# Altium schematic sheet 18_GPS_Interface.SchDoc: =TitleParameter
size A3; Address: Crete IL; Organization: ASISGUARD; Address1: Kemalpasa, Kemalpasa Cd. No:290 D:292H, 35060 Bornova/Izmir/Turkey
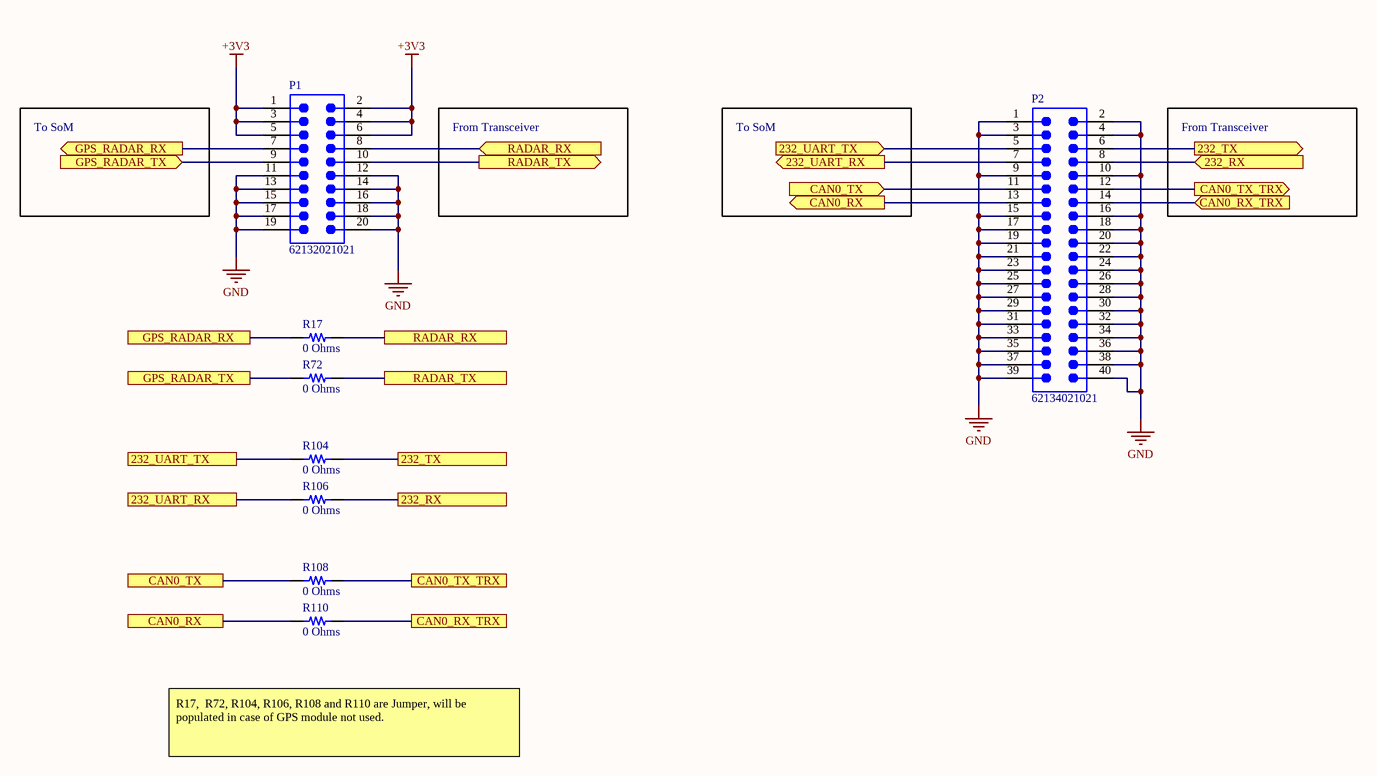
[diagram p0: 18_GPS_Interface.SchDoc]

## Parts
P1  62132021021  [62132021021]
P2  62134021021  [62134021021]
R17  0 Ohms  [RES0402(1005)]
R72  0 Ohms  [RES0402]
R104  0 Ohms  [RES0402(1005)]
R106  0 Ohms  [RES0402]
R108  0 Ohms  [RES0402(1005)]
R110  0 Ohms  [RES0402]

## Ports
232_RX, 232_RX (in), 232_TX, 232_TX (out), 232_UART_RX, 232_UART_RX (out), 232_UART_TX, 232_UART_TX (in), CAN0_RX, CAN0_RX (out), CAN0_RX_TRX, CAN0_RX_TRX (in), CAN0_TX, CAN0_TX (in), CAN0_TX_TRX, CAN0_TX_TRX (out), GPS_RADAR_RX, GPS_RADAR_RX (out), GPS_RADAR_TX, GPS_RADAR_TX (in), RADAR_RX, RADAR_RX (in), RADAR_TX, RADAR_TX (out)

## Nets
+3V3: P1.1 P1.2 P1.3 P1.4 P1.5 P1.6
GND: P1.11 P1.12 P1.13 P1.14 P1.15 P1.16 P1.17 P1.18 P1.19 P1.20 P2.1 P2.2 P2.3 P2.4 P2.9 P2.10 P2.15 P2.16 P2.17 P2.18 P2.19 P2.20 P2.21 P2.22 P2.23 P2.24 P2.25 P2.26 P2.27 P2.28 P2.29 P2.30 P2.31 P2.32 P2.33 P2.34 P2.35 P2.36 P2.37 P2.38 P2.39 P2.40
232_RX: P2.8 R106.1 ; port 232_RX
232_TX: P2.6 R104.1 ; port 232_TX
232_UART_RX: P2.7 R106.2 ; port 232_UART_RX
232_UART_TX: P2.5 R104.2 ; port 232_UART_TX
CAN0_RX: P2.13 R110.2 ; port CAN0_RX
CAN0_RX_TRX: P2.14 R110.1 ; port CAN0_RX_TRX
CAN0_TX: P2.11 R108.2 ; port CAN0_TX
CAN0_TX_TRX: P2.12 R108.1 ; port CAN0_TX_TRX
GPS_RADAR_RX: P1.7 R17.2 ; port GPS_RADAR_RX
GPS_RADAR_TX: P1.9 R72.2 ; port GPS_RADAR_TX
RADAR_RX: P1.8 R17.1 ; port RADAR_RX
RADAR_TX: P1.10 R72.1 ; port RADAR_TX

## Notes on the sheet
- To SoM
- From Transceiver
- R17,  R72, R104, R106, R108 and R110 are Jumper, will be populated in case of GPS module not used.
- Proje/Project:
- Sayfa Adı/Document Name:
- Çizilme Tarihi/Drawing Date
- Umit KAYACIK
- Tasarlayan/Designed By
- Sayfa/Sheet:
- Revision:
- of
- Son Güncelleme/Last Edit Date
- Kontrol eden/Checked By
- Onaylayan/Approved By
- Boyut/Size:
- Varyant/Variant:
- Dil/Language:
- A3
- ENG

## Library data of the parts
P1 = CMP-03913-122473367-2: 62132021021 Conn, Header, 20Pos, 2Row, 1.27Mm Rohs Compliant: Yes; NexarPartId: 122473367
P2 = CMP-03913-122473373-2: 62134021021 Conn, Header, 40Pos, 2Row, 1.27Mm Rohs Compliant: Yes; NexarPartId: 122473373
R17 R72 R104 R106 R108 R110 = HCJ0402ZT0R00: RES 0 OHM JUMPER 1/8W 0402; Manufacturer: Stackpole Electronics Inc; Power (Watts): 0.125W, 1/8W; Part Number: HCJ0402ZT0R00; Value: 0 Ohms; ComponentLink1Description: Datasheet; ComponentLink1URL: https://www.seielect.com/catalog/sei-hcj.pdf; ComponentLink2Description: DigiKey Link; ComponentLink2URL: https://www.digikey.com/en/products/detail/stackpole-electronics-inc/HCJ0402ZT0R00/4357659; Composition: Metal Foil; Device Package: 0402 (1005 Metric); Features: Automotive AEC-Q200; Height - Seated (Max): 0.018" (0.45mm); LastUpdated: 2/9/2024 8:29:49 PM; Lifecycle Status: Active; Minimum Order: 1; Number of Terminations: 2; Operating Temperature: -55°C ~ 155°C; Package / Case: 0402 (1005 Metric); Packaging: TapeAndReel; PartId: 12327; Part Status: Active; Price: 0.07; Ratings: AEC-Q200; Resistance: 0 Ohms; Series: HCJ; Size / Dimension: 0.039" L x 0.020" W (1.00mm x 0.50mm); Supplier 1: DigiKey; Supplier Part Number 1: HCJ0402ZT0R00CT-ND; Supplier Device Package: 0402; Tolerance: Jumper